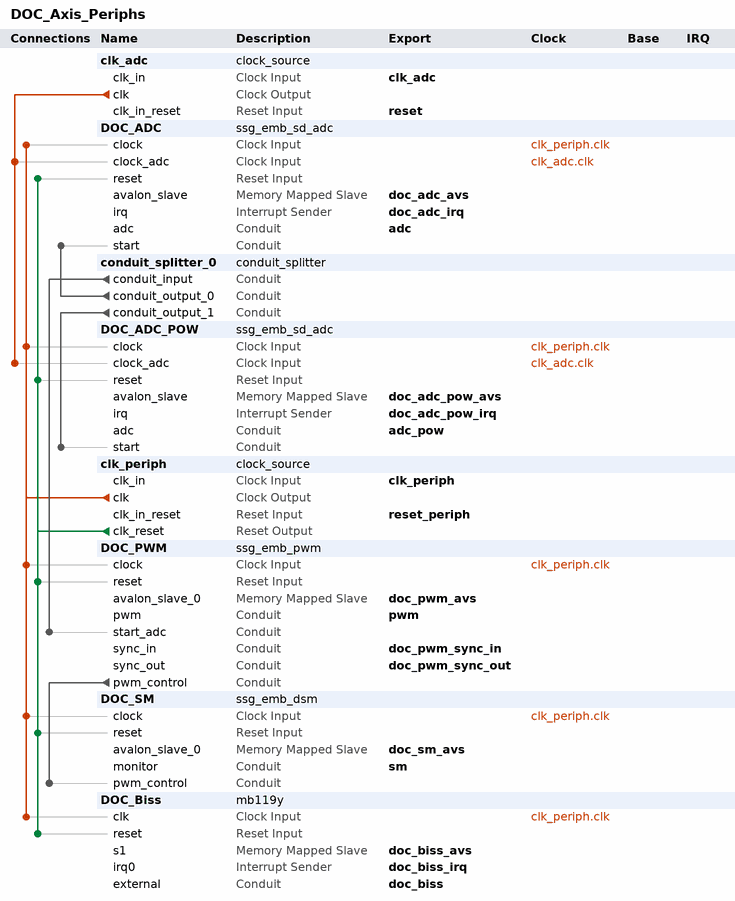
[diagram p0: system contents]
# Platform Designer (Qsys) system DOC_Axis_Periphs, Cyclone IV E EP4CE115F29C7
# Parameters at their usual value, and those the tool derives, are not listed.
package require -exact qsys 14.0
create_system DOC_Axis_Periphs
set_project_property DEVICE_FAMILY {Cyclone IV E}
set_project_property DEVICE EP4CE115F29C7

add_instance clk_adc clock_source 14.0
set_instance_parameter_value clk_adc clockFrequency 20000000

add_instance DOC_ADC ssg_emb_sd_adc 1.4

add_instance conduit_splitter_0 conduit_splitter 14.0
set_instance_parameter_value conduit_splitter_0 OUTPUT_NUM 2

add_instance DOC_ADC_POW ssg_emb_sd_adc 1.4

add_instance clk_periph clock_source 14.0
set_instance_parameter_value clk_periph clockFrequency 50000000

add_instance DOC_PWM ssg_emb_pwm 1.2

add_instance DOC_SM ssg_emb_dsm 1.2
set_instance_parameter_value DOC_SM init 0
set_instance_parameter_value DOC_SM prech 1
set_instance_parameter_value DOC_SM prer 2
set_instance_parameter_value DOC_SM run 3
set_instance_parameter_value DOC_SM error 4
set_instance_parameter_value DOC_SM pwm_disable 0
set_instance_parameter_value DOC_SM pwm_enable 1
set_instance_parameter_value DOC_SM pwm_lower 3
set_instance_parameter_value DOC_SM pwm_both 7

add_instance DOC_Biss mb119y 1.0
set_instance_parameter_value DOC_Biss Slaves 1
set_instance_parameter_value DOC_Biss NumRegs 8

# connections
add_connection clk_adc.clk DOC_ADC.clock_adc clock
add_connection clk_adc.clk DOC_ADC_POW.clock_adc clock
add_connection clk_periph.clk DOC_ADC.clock clock
add_connection clk_periph.clk DOC_ADC_POW.clock clock
add_connection clk_periph.clk DOC_Biss.clk clock
add_connection clk_periph.clk DOC_PWM.clock clock
add_connection clk_periph.clk DOC_SM.clock clock
add_connection clk_periph.clk_reset DOC_ADC.reset reset
add_connection clk_periph.clk_reset DOC_ADC_POW.reset reset
add_connection clk_periph.clk_reset DOC_Biss.reset reset
add_connection clk_periph.clk_reset DOC_PWM.reset reset
add_connection clk_periph.clk_reset DOC_SM.reset reset
add_connection conduit_splitter_0.conduit_input DOC_PWM.start_adc conduit
add_connection conduit_splitter_0.conduit_output_0 DOC_ADC.start conduit
add_connection conduit_splitter_0.conduit_output_1 DOC_ADC_POW.start conduit
add_connection DOC_PWM.pwm_control DOC_SM.pwm_control conduit

# exported interfaces
add_interface clk_adc clock sink
set_interface_property clk_adc EXPORT_OF clk_adc.clk_in
add_interface reset reset sink
set_interface_property reset EXPORT_OF clk_adc.clk_in_reset
add_interface clk_periph clock sink
set_interface_property clk_periph EXPORT_OF clk_periph.clk_in
add_interface reset_periph reset sink
set_interface_property reset_periph EXPORT_OF clk_periph.clk_in_reset
add_interface doc_adc_avs avalon slave
set_interface_property doc_adc_avs EXPORT_OF DOC_ADC.avalon_slave
add_interface doc_adc_irq interrupt sender
set_interface_property doc_adc_irq EXPORT_OF DOC_ADC.irq
add_interface doc_pwm_avs avalon slave
set_interface_property doc_pwm_avs EXPORT_OF DOC_PWM.avalon_slave_0
add_interface doc_sm_avs avalon slave
set_interface_property doc_sm_avs EXPORT_OF DOC_SM.avalon_slave_0
add_interface doc_adc_pow_avs avalon slave
set_interface_property doc_adc_pow_avs EXPORT_OF DOC_ADC_POW.avalon_slave
add_interface doc_adc_pow_irq interrupt sender
set_interface_property doc_adc_pow_irq EXPORT_OF DOC_ADC_POW.irq
add_interface doc_pwm_sync_out conduit end
set_interface_property doc_pwm_sync_out EXPORT_OF DOC_PWM.sync_out
add_interface doc_pwm_sync_in conduit end
set_interface_property doc_pwm_sync_in EXPORT_OF DOC_PWM.sync_in
add_interface adc_pow conduit end
set_interface_property adc_pow EXPORT_OF DOC_ADC_POW.adc
add_interface adc conduit end
set_interface_property adc EXPORT_OF DOC_ADC.adc
add_interface pwm conduit end
set_interface_property pwm EXPORT_OF DOC_PWM.pwm
add_interface sm conduit end
set_interface_property sm EXPORT_OF DOC_SM.monitor
add_interface doc_biss_avs avalon slave
set_interface_property doc_biss_avs EXPORT_OF DOC_Biss.s1
add_interface doc_biss conduit end
set_interface_property doc_biss EXPORT_OF DOC_Biss.external
add_interface doc_biss_irq interrupt sender
set_interface_property doc_biss_irq EXPORT_OF DOC_Biss.irq0

set_interconnect_requirement {$system} qsys_mm.clockCrossingAdapter HANDSHAKE
set_interconnect_requirement {$system} qsys_mm.maxAdditionalLatency 0

save_system DOC_Axis_Periphs.qsys
